# Altium project HYDRA_V4_NAV.PrjPcb (part 2 of 2)
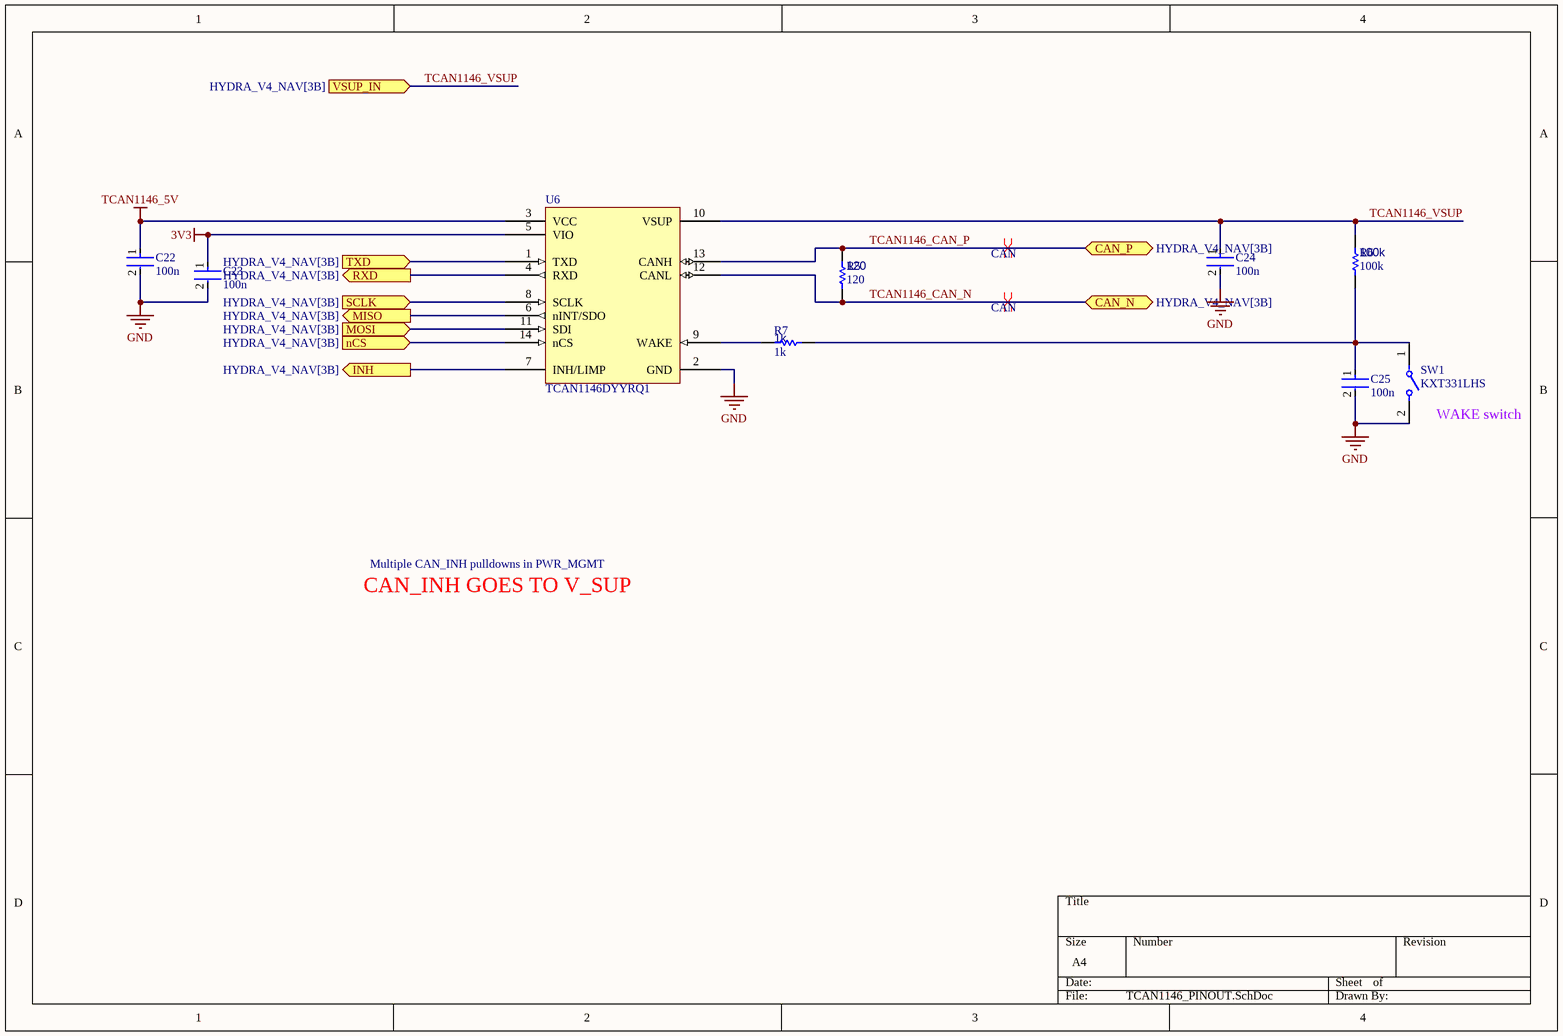
[diagram p10: TCAN1146_PINOUT.SchDoc]

## Nets that join several sheets
3V3: HYDRA_V4_NAV (R22.1 R25.1 R28.1 R30.1), STM32H730_PINOUT (20 pins), IMU (23 pins), GPS (6 pins), SD (10 pins), OC_PROT (D1.2 R21.1 U3.10), ACTUATOR_PWR_PROT (D5.3 R54.1), FDCAN_1 (C2_FDCAN_1.1 U2_FDCAN_1.3), TCAN1146_PINOUT (C23.1 U6.5), FDCAN_2 (C2_FDCAN_2.1 U2_FDCAN_2.3)
GND: HYDRA_V4_NAV (43 pins), STM32H730_PINOUT (33 pins), IMU (27 pins), GPS (14 pins), SD (7 pins), OC_PROT (13 pins), ACTUATOR_PWR_PROT (17 pins), FDCAN_1 (C2_FDCAN_1.2 U2_FDCAN_1.2), TCAN1146_PINOUT (6 pins), FDCAN_2 (C2_FDCAN_2.2 U2_FDCAN_2.2)
TCAN1146_5V: HYDRA_V4_NAV (F2.2 R10.1), TCAN1146_PINOUT (C22.1 U6.3)
TCAN1146_VSUP: HYDRA_V4_NAV (J1.01 J1.02 J4.01 J4.02), OC_PROT (Q17.2 R67.1), TCAN1146_PINOUT (C24.1 R6.2 U6.10)
ACT_PWR: HYDRA_V4_NAV (J3.3 J3.4), ACTUATOR_PWR_PROT (10 pins)
BARO0_nCS: STM32H730_PINOUT (U1.2), IMU (U9.4 U9.5)
BARO1_nCS: STM32H730_PINOUT (U1.3), IMU (U11.3)
BARO_MISO: STM32H730_PINOUT (U1.4), IMU (U9.6 U11.8)
BARO_MOSI: STM32H730_PINOUT (U1.5), IMU (U9.7 U11.7)
BARO_SCLK: STM32H730_PINOUT (U1.1), IMU (U9.8 U11.1)
CAN0_N: HYDRA_V4_NAV (J1.16 J4.16), TCAN1146_PINOUT (R5.1 U6.12)
CAN0_P: HYDRA_V4_NAV (J1.15 J4.15), TCAN1146_PINOUT (R5.2 U6.13)
CAN1_N: HYDRA_V4_NAV (J1.20 J4.20), FDCAN_1 (R3_FDCAN_1.1 U2_FDCAN_1.6)
CAN1_P: HYDRA_V4_NAV (J1.19 J4.19), FDCAN_1 (R3_FDCAN_1.2 U2_FDCAN_1.7)
CAN2_N: HYDRA_V4_NAV (J8.1), FDCAN_2 (R3_FDCAN_2.1 U2_FDCAN_2.6)
CAN2_P: HYDRA_V4_NAV (J8.2), FDCAN_2 (R3_FDCAN_2.2 U2_FDCAN_2.7)
GPS_ENABLE: STM32H730_PINOUT (U1.97), GPS (R44.2)
GPS_nRESET: STM32H730_PINOUT (U1.93), GPS (R65.2 U12.9)
IMU0_nCS: STM32H730_PINOUT (U1.87), IMU (U8.23)
IMU0_nRESET: STM32H730_PINOUT (U1.85), IMU (R46.2 U8.18)
IMU0_ODR: STM32H730_PINOUT (U1.84), IMU (R47.2 U8.12)
IMU1_INT1: STM32H730_PINOUT (U1.88), IMU (R49.2 U10.4)
IMU1_INT2: STM32H730_PINOUT (U1.90), IMU (R50.2 U10.9)
IMU1_nCS: STM32H730_PINOUT (U1.28), IMU (U10.12)
IMU_MISO: STM32H730_PINOUT (U1.30), IMU (U8.9 U10.1)
IMU_MOSI: STM32H730_PINOUT (U1.31), IMU (U8.1 U10.14)
IMU_SCLK: STM32H730_PINOUT (U1.29), IMU (U8.24 U10.13)
MAG_SCL: STM32H730_PINOUT (U1.46), IMU (R64.2 U4.A2)
MAG_SDA: STM32H730_PINOUT (U1.47), IMU (R63.2 U4.B2)
MCU_G_LED: HYDRA_V4_NAV (D2.1), STM32H730_PINOUT (U1.22)
MCU_R_LED: HYDRA_V4_NAV (D2.4), STM32H730_PINOUT (U1.23)
NAV_G_LED: HYDRA_V4_NAV (D4.1), STM32H730_PINOUT (U1.15)
NAV_R_LED: HYDRA_V4_NAV (D4.4), STM32H730_PINOUT (U1.16)
NetC1_1: STM32H730_PINOUT (U1.33), ACTUATOR_PWR_PROT (C1.1 R19.2)
NetR10_2: HYDRA_V4_NAV (R10.2 R16.1), STM32H730_PINOUT (U1.25)
NetR14_1: STM32H730_PINOUT (U1.34), OC_PROT (R14.1 U3.9)
NetR21_2: STM32H730_PINOUT (U1.18), OC_PROT (R21.2 R36.1)
NetR51_2: STM32H730_PINOUT (U1.32), ACTUATOR_PWR_PROT (R51.2 R53.1)
NetR61_1: STM32H730_PINOUT (U1.7), ACTUATOR_PWR_PROT (R61.1)
NetR67_2: STM32H730_PINOUT (U1.35), OC_PROT (R67.2 R68.1)
NetU1_51: STM32H730_PINOUT (U1.51), TCAN1146_PINOUT (U6.14)
NetU1_52: STM32H730_PINOUT (U1.52), TCAN1146_PINOUT (U6.8)
NetU1_53: STM32H730_PINOUT (U1.53), TCAN1146_PINOUT (U6.6)
NetU1_54: STM32H730_PINOUT (U1.54), TCAN1146_PINOUT (U6.11)
NetU1_59: STM32H730_PINOUT (U1.59), TCAN1146_PINOUT (U6.4)
NetU1_60: STM32H730_PINOUT (U1.60), TCAN1146_PINOUT (U6.1)
NetU1_70: STM32H730_PINOUT (U1.70), FDCAN_1 (U2_FDCAN_1.4)
NetU1_71: STM32H730_PINOUT (U1.71), FDCAN_1 (U2_FDCAN_1.1)
NetU1_91: STM32H730_PINOUT (U1.91), FDCAN_2 (U2_FDCAN_2.4)
NetU1_92: STM32H730_PINOUT (U1.92), FDCAN_2 (U2_FDCAN_2.1)
PG: STM32H730_PINOUT (U1.98), ACTUATOR_PWR_PROT (R54.2 R60.2 U14.13)
PRE_3V3: HYDRA_V4_NAV (8 pins), OC_PROT (C15.1 R9.1 U3.1 U3.2)
PRE_ZENER_CAN_INH: OC_PROT (R4.2 R20.2), TCAN1146_PINOUT (U6.7)
PYRO_PWR: HYDRA_V4_NAV (16 pins), ACTUATOR_PWR_PROT (F1.1)
RXD: STM32H730_PINOUT (U1.96), GPS (U12.3)
SD_CD: STM32H730_PINOUT (U1.86), SD (R35.2 SD1.9)
SD_CLK: STM32H730_PINOUT (U1.80), SD (R24.2 SD1.5)
SD_CMD: STM32H730_PINOUT (U1.83), SD (R23.2 SD1.3)
SD_DAT0: STM32H730_PINOUT (U1.65), SD (R31.2 SD1.7)
SD_DAT1: STM32H730_PINOUT (U1.66), SD (R32.2 SD1.8)
SD_DAT2: STM32H730_PINOUT (U1.78), SD (R33.2 SD1.1)
SD_DAT3: STM32H730_PINOUT (U1.79), SD (R34.2 SD1.2)
TXD: STM32H730_PINOUT (U1.95), GPS (U12.2)